# Altium schematic sheet POWER_SUPPLY.SchDoc
size B; Author: Michael Jones; Engineer: Eli Hughes; Address1: 1652 W 820 N; Address2: Provo; Address3: UT  84601; Address4: 801-379-0118; DocumentNumber: 2; Revision: A3; SheetNumber: 2; SheetTotal: 6
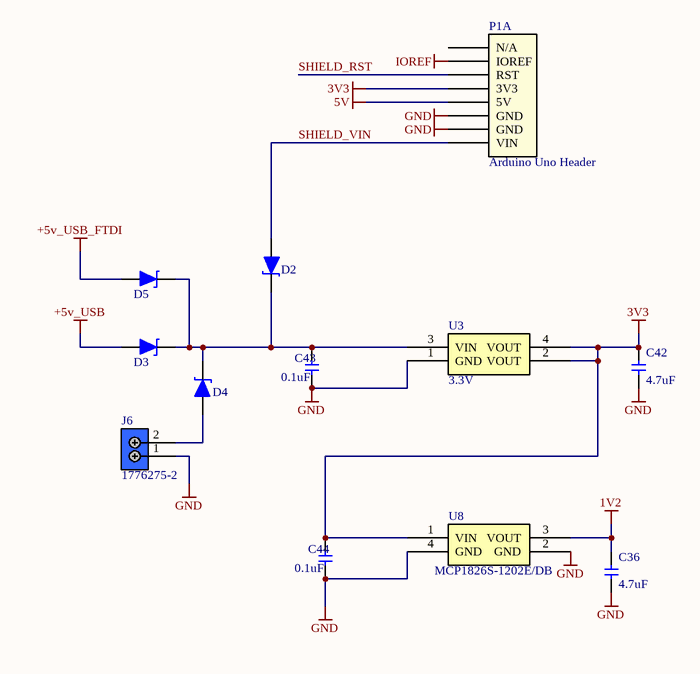
[diagram p0: POWER_SUPPLY.SchDoc]

## Parts
C36  4.7uF  [C0603]
C42  4.7uF  [C0603]
C43  0.1uF  [C0603]
C44  0.1uF  [C0603]
D2  RB161M-20TR  [SOD-123]  (value not drawn)
D3  RB161M-20TR  [SOD-123]  (value not drawn)
D4  RB161M-20TR  [SOD-123]  (value not drawn)
D5  RB161M-20TR  [SOD-123]  (value not drawn)
J6  1776275-2  [1776275-2]
P1  Arduino Uno Header  [Arduino Shield]  (part A of 4)
U3  3.3V  [SOT223]
U8  MCP1826S-1202E/DB  [SOT223]

## Nets
1V2: C36.2 U8.3(VOUT)
3V3: C42.2 C44.2 P1.A2(3V3) U3.2(VOUT) U3.4(VOUT) U8.1(VIN)
5V: P1.A3(5V)
+5v_USB: D3.2(A)
+5v_USB_FTDI: D5.2(A)
GND: C36.1 C42.1 C43.1 C44.1 J6.1 P1.A4(GND) P1.A5(GND) U3.1(GND) U8.2(GND) U8.4(GND)
IOREF: P1.A0(IOREF)
SHIELD_RST: P1.A1(RST)
SHIELD_VIN: D2.2(A) P1.A6(VIN)
NetC43_2: C43.2 D2.1(C) D3.1(C) D4.1(C) D5.1(C) U3.3(VIN)
NetD4_2: D4.2(A) J6.2

Not connected (* = marked no-connect by the designer): P1 A-1(N/A)

## Notes on the sheet
- 2
- Wavenumber
- pl
- -1
- Rev:
- Technologies
- Sheet
- of

## Library data of the parts
C36 C42 = GRM188R60J475KE19D: CAP CER 4.7UF 6.3V X5R 0603; Manufacturer: Murata Electronics North America; Capacitance: 4.7µF; Tolerance: ±10%; Supplier 1: Digi-Key; Supplier Part Number 1: 490-3297-1-ND; Manufacturer Part Number: GRM188R60J475KE19D; RoHS: RoHS Compliant; Category: Capacitors; Stock 1: 714091; Pricing 1: 10=0.214, 50=0.148, 100=0.1142, 250=0.08204, 500=0.0585, 1000=0.04281 (USD); Voltage - Rated: 6.3V; Temperature Coefficient: X5R; Mounting Type: Surface Mount, MLCC; Operating Temperature: -55°C ~ 85°C; Applications: General Purpose; Ratings: -; Package / Case: 0603 (1608 Metric); Size / Dimension: 0.063" L x 0.031" W (1.60mm x 0.80mm); Height: -; Thickness: 0.035" (0.90mm); Lead Spacing: -; Features: -; Packaging: Cut Tape (CT); Lead Style: -; ComponentLink1URL: http://search.murata.co.jp/Ceramy/image/img/PDF/ENG/GRM188R60J475KE19.pdf; ComponentLink1Description: http://search.murata.co.jp/Ceramy/image/img/PDF/ENG/GRM188R60J475KE19.pdf; Value: 4.7uF
C43 C44 = GRM188R71H104KA93D: CAP CER .1UF 50V 10% X7R 0603; Manufacturer: Murata Electronics North America; Capacitance: 0.1µF; Value: 0.1uF; Supplier 1: Digi-Key; Supplier Part Number 1: 490-1519-1-ND; Manufacturer Part Number: GRM188R71H104KA93D; RoHS: RoHS Compliant; Category: Capacitors; Stock 1: 6315460; Pricing 1: 10=0.037, 100=0.0221, 500=0.01276, 1000=0.00884 (USD); Voltage - Rated: 50V; Tolerance: ±10%; Temperature Coefficient: X7R; Mounting Type: Surface Mount, MLCC; Operating Temperature: -55°C ~ 125°C; Features: -; Applications: General Purpose; Ratings: -; Package / Case: 0603 (1608 Metric); Size / Dimension: 0.063" L x 0.031" W (1.60mm x 0.80mm); Lead Spacing: -; Thickness: 0.80mm; Packaging: Cut Tape (CT); Lead Style: -; ComponentLink1URL: http://search.murata.co.jp/Ceramy/image/img/PDF/ENG/GRM188R71H104KA93.pdf; ComponentLink1Description: http://search.murata.co.jp/Ceramy/image/img/PDF/ENG/GRM188R71H104KA93.pdf
D2-D5 = RB161M-20TR: DIODE SCHOTTKY 25V 1A SOD123; Source Part Number: RB161M-20CT-ND; Manufacturer: Diodes Inc; Manufacturer Part Number: Rohm Semiconductor; Description: DIODE SCHOTTKY 20V 1A SOD123; Voltage - Forward (Vf) (Max) @ If: 350mV @ 1A; Voltage - DC Reverse (Vr) (Max): 20V; Current - Reverse Leakage @ Vr: 700µA @ 20V; Speed: Fast Recovery =< 500ns, > 200mA (Io); Source: Digikey; Value: RB161M-20TR; Supplier 1: Digi-Key; RoHS: RoHS Compliant; Category: Discrete Semiconductor Products; Stock 1: 29589; Pricing 1: 1=0.58, 25=0.4044, 100=0.3465, 250=0.29924, 500=0.25726, 1000=0.1995 (USD); Current - Average Rectified (Io): 1A; Diode Type: Schottky; Reverse Recovery Time (trr): -; Capacitance @ Vr, F: -; Mounting Type: Surface Mount; Package / Case: SOD-123F; Supplier Device Package: PMDU; Packaging: Cut Tape (CT); ComponentLink1URL: http://www.rohm.com/products/databook/di/pdf/rb161m-20.pdf; ComponentLink1Description: http://www.rohm.com/products/databook/di/pdf/rb161m-20.pdf; Supplier Part Number 1: RB161M-20CT-ND
J6 = 1776275-2: TERM BLOCK 2POS SIDE ENT 3.5MM; Manufacturer: TE Connectivity; Number of Levels: 1; Positions Per Level: 2; Pitch: 0.138" (3.50mm); Mating Orientation: Horizontal with Board; Current: 7A; Voltage: 250V; Wire Gauge: 18-26 AWG; Wire Termination: Screw - Leaf Spring, Wire Guard; Clamp Material - Plating: Steel, Stainless; Screw Material - Plating: Steel, Galvanized - Chromate Plated; Torque - Screw: 0.28 Nm (2.5 Lb-In); Screw Thread: M2.6; Supplier 1: Digi-Key; Supplier Part Number 1: A98036-ND; Manufacturer Part Number: 1776275-2; RoHS: RoHS Compliant; Category: Connectors, Interconnects; Stock 1: 46916; Pricing 1: 1=0.44, 10=0.417, 25=0.3572, 50=0.3036, 100=0.2917, 250=0.26196, 500=0.25004, 1000=0.20837, 2500=0.19051 (USD); Mounting Type: Through Hole; Features: Interlocking (Side); Color: Blue; Packaging: Bulk; Operating Temperature: -55°C ~ 105°C; Housing Material: Polyamide (PA66), Nylon 6/6; Contact Material - Plating: Brass - Copper Tin Plated; ComponentLink1URL: http://documents.tycoelectronics.com/commerce/DocumentDelivery/DDEController?Action=srchrtrv&DocNm=1776275&DocType=CD&DocLang=EN; ComponentLink1Description: http://documents.tycoelectronics.com/commerce/DocumentDelivery/DDEController?Action=srchrtrv&DocNm=1776275&DocType=CD&DocLang=EN; Value: 1776275-2
P1 = Arduino Shield: Arduino Duem Header
U3 = LD1117S33CTR: IC REG LDO 3.3V 950MA SOT-223; Manufacturer: STMicroelectronics; Regulator Topology: Positive Fixed; Voltage - Input: Up to 15V; Voltage - Dropout (Typical): 1.1V @ 800mA; Number of Regulators: 1; Supplier 1: Digi-Key; Supplier Part Number 1: 497-1241-1-ND; Manufacturer Part Number: LD1117S33CTR; RoHS: RoHS Compliant; Category: Integrated Circuits (ICs); Stock 1: 20460; Pricing 1: 1=0.54, 10=0.436, 100=0.3267, 250=0.28216, 500=0.24256, 1000=0.1881 (USD); Voltage - Output: 3.3V; Current - Output: 950mA; Current - Limit (Min): -; Operating Temperature: -40°C ~ 125°C; Mounting Type: Surface Mount; Package / Case: TO-261-4, TO-261AA; Supplier Device Package: SOT-223; Packaging: Cut Tape (CT); ComponentLink1URL: http://www.st.com/internet/com/TECHNICAL_RESOURCES/TECHNICAL_LITERATURE/DATASHEET/CD00000544.pdf; ComponentLink1Description: http://www.st.com/internet/com/TECHNICAL_RESOURCES/TECHNICAL_LITERATURE/DATASHEET/CD00000544.pdf; value: LD1117S33CTR
U8 = MCP1826S-1202E/DB: IC LDO REG 1A 1.2V SOT223-3; Manufacturer: Microchip Technology; Regulator Topology: Positive Fixed; Voltage - Input: Up to 6V; Voltage - Dropout (Typical): 0.25V @ 1A; Number of Regulators: 1; Current - Output: 1A (Min); Value: MCP1826S-1202E/DB; Supplier 1: Digi-Key; Supplier Part Number 1: MCP1826S-1202E/DB-ND; Manufacturer Part Number: MCP1826S-1202E/DB; RoHS: RoHS Compliant; Category: Integrated Circuits (ICs); Stock 1: 2041; Pricing 1: 1=0.74, 10=0.68, 25=0.57, 100=0.52 (USD); Voltage - Output: 1.2V; Current - Limit (Min): -; Operating Temperature: -40°C ~ 125°C; Mounting Type: Surface Mount; Package / Case: TO-261-4, TO-261AA; Supplier Device Package: SOT-223-3; Packaging: Tube; ComponentLink1URL: http://ww1.microchip.com/downloads/en/DeviceDoc/22057a.pdf; ComponentLink1Description: http://ww1.microchip.com/downloads/en/DeviceDoc/22057a.pdf